# Altium schematic sheet Memory.SchDoc
size C; DocumentNumber: 7; SheetNumber: 7
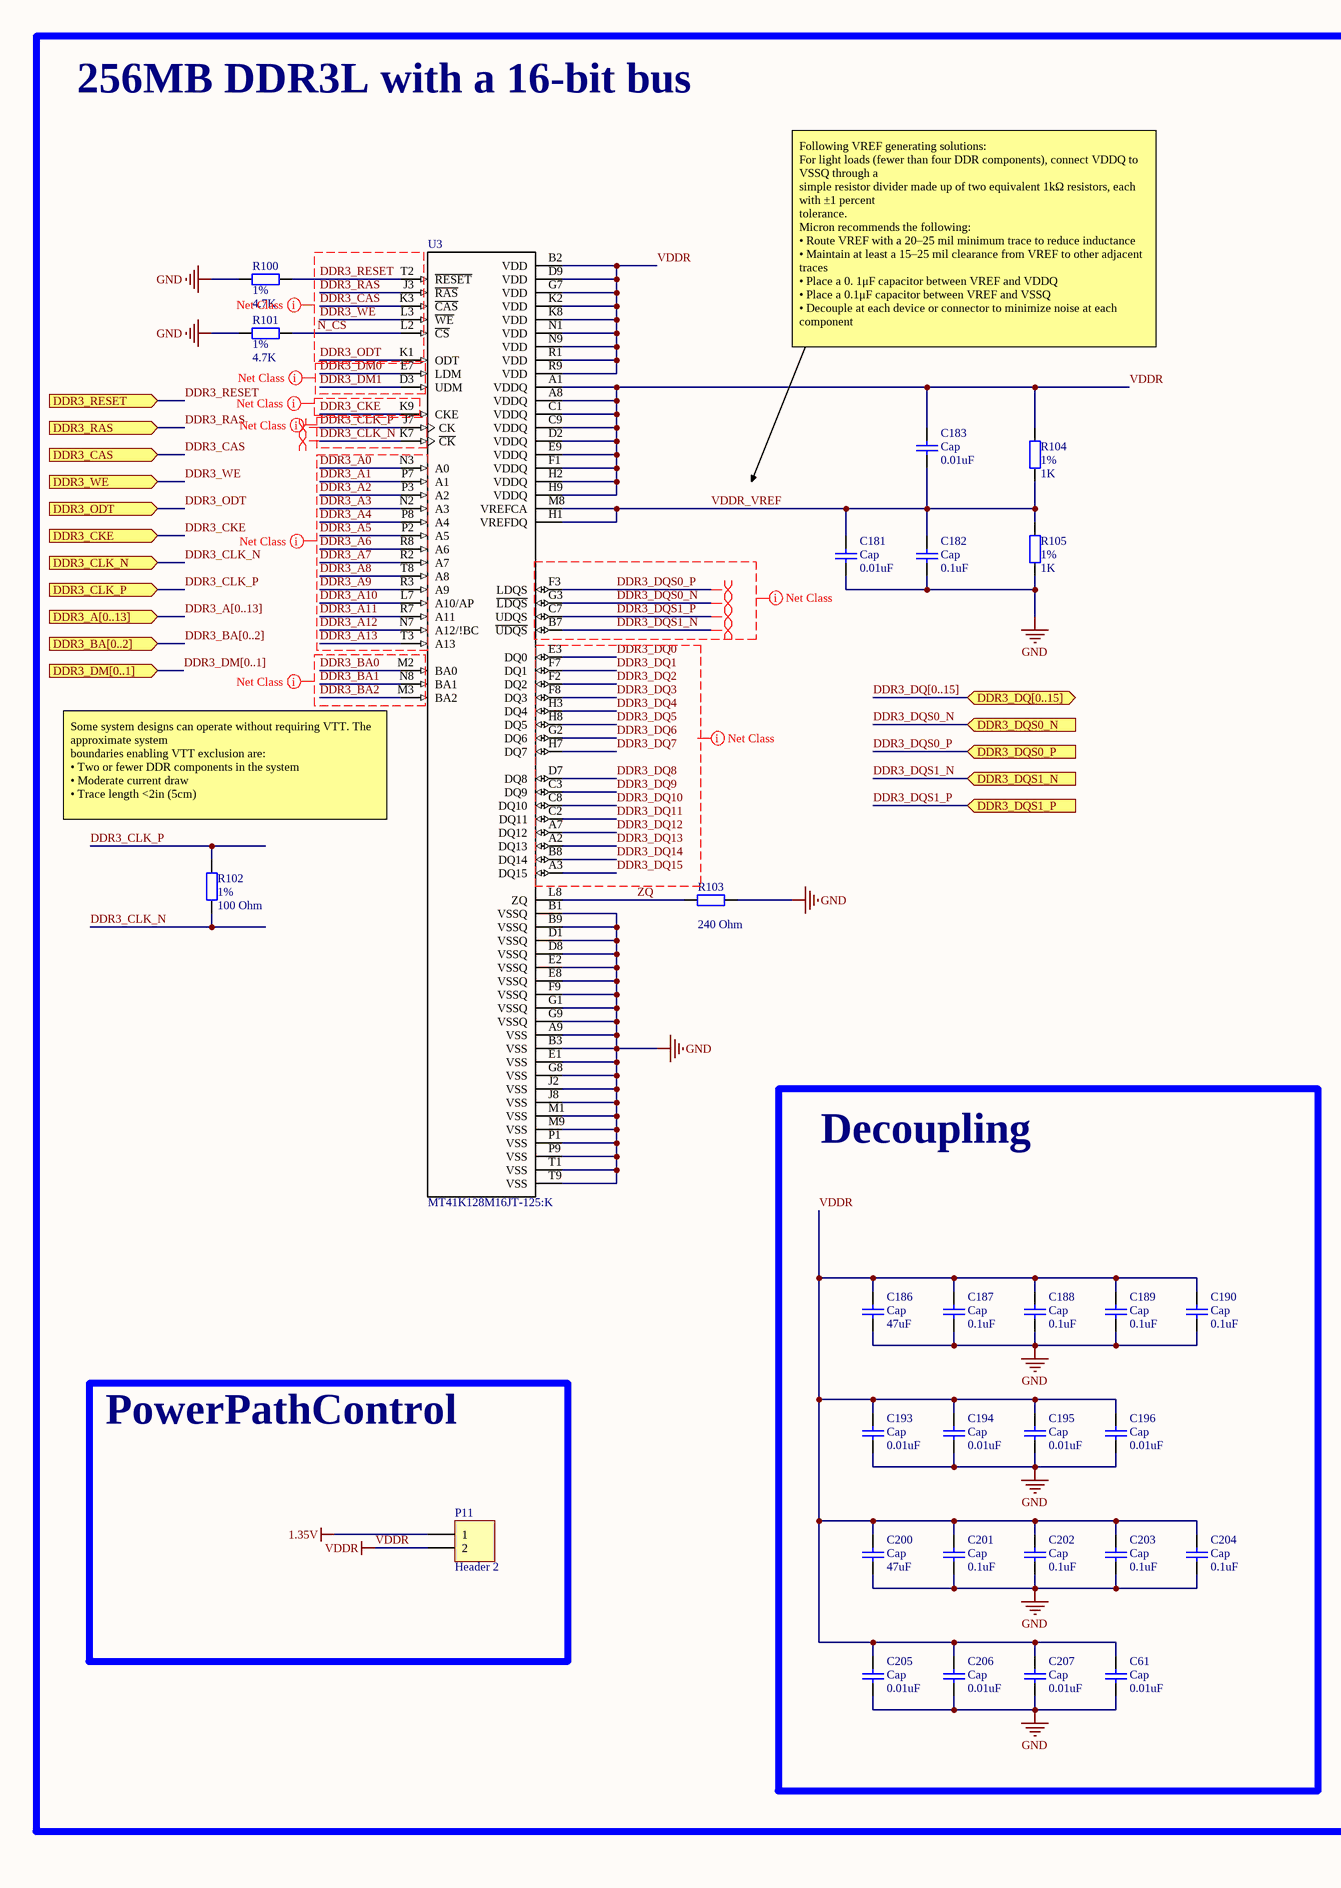
[diagram p0: Memory.SchDoc, left]
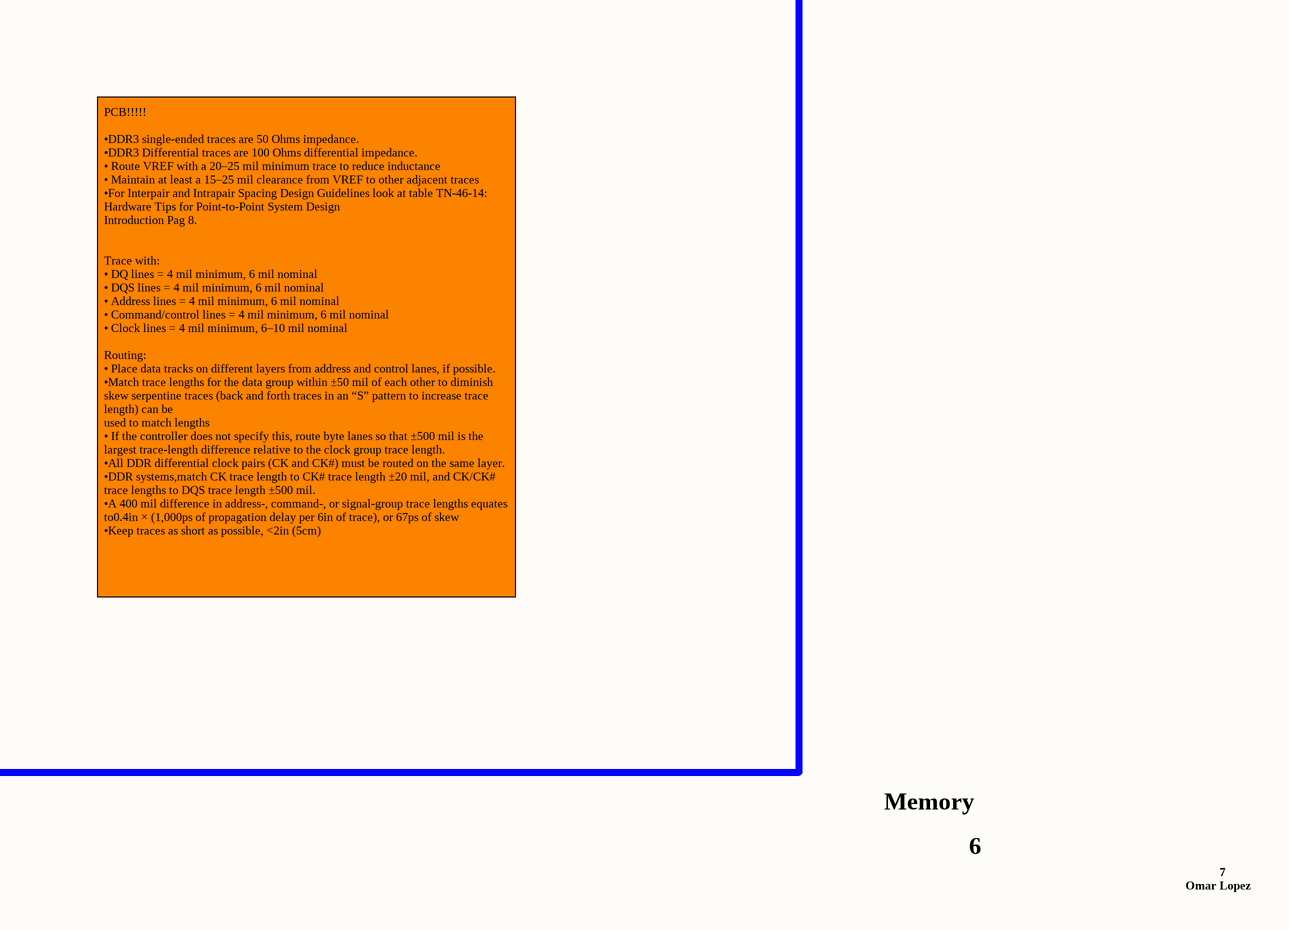
[diagram p1: Memory.SchDoc, right]

## Parts
C61  Cap  value 0.01uF  [GRM0402MurataCap]
C181  Cap  value 0.01uF  [GRM0402MurataCap]
C182  Cap  value 0.1uF  [GRM0402MurataCap]
C183  Cap  value 0.01uF  [GRM0402MurataCap]
C186  Cap  value 47uF  [TaiyoYudenCapMK212]
C187  Cap  value 0.1uF  [GRM0402MurataCap]
C188  Cap  value 0.1uF  [GRM0402MurataCap]
C189  Cap  value 0.1uF  [GRM0402MurataCap]
C190  Cap  value 0.1uF  [GRM0402MurataCap]
C193  Cap  value 0.01uF  [GRM0402MurataCap]
C194  Cap  value 0.01uF  [GRM0402MurataCap]
C195  Cap  value 0.01uF  [GRM0402MurataCap]
C196  Cap  value 0.01uF  [GRM0402MurataCap]
C200  Cap  value 47uF  [TaiyoYudenCapMK212]
C201  Cap  value 0.1uF  [GRM0402MurataCap]
C202  Cap  value 0.1uF  [GRM0402MurataCap]
C203  Cap  value 0.1uF  [GRM0402MurataCap]
C204  Cap  value 0.1uF  [GRM0402MurataCap]
C205  Cap  value 0.01uF  [GRM0402MurataCap]
C206  Cap  value 0.01uF  [GRM0402MurataCap]
C207  Cap  value 0.01uF  [GRM0402MurataCap]
P11  Header 2  [Header2x1]
R100  1%  value 4.7K  [0402Resistor]
R101  1%  value 4.7K  [0402Resistor]
R102  1%  value 100 Ohm  [RC0402N]
R103  value 240 Ohm  [0402Resistor]
R104  1%  value 1K  [RC0402N]
R105  1%  value 1K  [RC0402N]
U3  MT41K128M16JT-125:K  [BGA80P96C6X16_800X1400X110_MT41K128M16JT-125:K(Primary)]

## Blocks framed on the sheet
256MB DDR3L with a 16-bit bus: C181-C183 R100-R105 U3
Decoupling: C61 C186-C190 C193-C196 C200-C207
PowerPathControl: P11

## Ports
DDR3_A[0..13] (in), DDR3_BA[0..2] (in), DDR3_CAS (in), DDR3_CKE (in), DDR3_CLK_N (in), DDR3_CLK_P (in), DDR3_DM[0..1] (in), DDR3_DQ[0..15] (bidir), DDR3_DQS0_N (in), DDR3_DQS0_P (in), DDR3_DQS1_N (in), DDR3_DQS1_P (in), DDR3_ODT (in), DDR3_RAS (in), DDR3_RESET (in), DDR3_WE (in)

## Nets
1.35V: P11.1
GND: C61.2 C181.2 C182.2 C186.2 C187.2 C188.2 C189.2 C190.2 C193.2 C194.2 C195.2 C196.2 C200.2 C201.2 C202.2 C203.2 C204.2 C205.2 C206.2 C207.2 R100.2 R101.2 R103.2 R105.2 U3.A9(VSS) U3.B1(VSSQ) U3.B3(VSS) U3.B9(VSSQ) U3.D1(VSSQ) U3.D8(VSSQ) U3.E1(VSS) U3.E2(VSSQ) U3.E8(VSSQ) U3.F9(VSSQ) U3.G1(VSSQ) U3.G8(VSS) U3.G9(VSSQ) U3.J2(VSS) U3.J8(VSS) U3.M1(VSS) U3.M9(VSS) U3.P1(VSS) U3.P9(VSS) U3.T1(VSS) U3.T9(VSS)
VDDR: C61.1 C183.1 C186.1 C187.1 C188.1 C189.1 C190.1 C193.1 C194.1 C195.1 C196.1 C200.1 C201.1 C202.1 C203.1 C204.1 C205.1 C206.1 C207.1 P11.2 R104.1 U3.A1(VDDQ) U3.A8(VDDQ) U3.B2(VDD) U3.C1(VDDQ) U3.C9(VDDQ) U3.D2(VDDQ) U3.D9(VDD) U3.E9(VDDQ) U3.F1(VDDQ) U3.G7(VDD) U3.H2(VDDQ) U3.H9(VDDQ) U3.K2(VDD) U3.K8(VDD) U3.N1(VDD) U3.N9(VDD) U3.R1(VDD) U3.R9(VDD)
DDR3_A0: U3.N3(A0)
DDR3_A1: U3.P7(A1)
DDR3_A2: U3.P3(A2)
DDR3_A3: U3.N2(A3)
DDR3_A4: U3.P8(A4)
DDR3_A5: U3.P2(A5)
DDR3_A6: U3.R8(A6)
DDR3_A7: U3.R2(A7)
DDR3_A8: U3.T8(A8)
DDR3_A9: U3.R3(A9)
DDR3_A10: U3.L7(A10/AP)
DDR3_A11: U3.R7(A11)
DDR3_A12: U3.N7(A12/!BC)
DDR3_A13: U3.T3(A13)
DDR3_BA0: U3.M2(BA0)
DDR3_BA1: U3.N8(BA1)
DDR3_BA2: U3.M3(BA2)
DDR3_CAS: U3.K3(~{CAS}) ; port DDR3_CAS
DDR3_CKE: U3.K9(CKE) ; port DDR3_CKE
DDR3_CLK_N: R102.1 U3.K7(~{CK}) ; port DDR3_CLK_N
DDR3_CLK_P: R102.2 U3.J7(CK) ; port DDR3_CLK_P
DDR3_DM0: U3.E7(LDM)
DDR3_DM1: U3.D3(UDM)
DDR3_DQ0: U3.E3(DQ0)
DDR3_DQ1: U3.F7(DQ1)
DDR3_DQ2: U3.F2(DQ2)
DDR3_DQ3: U3.F8(DQ3)
DDR3_DQ4: U3.H3(DQ4)
DDR3_DQ5: U3.H8(DQ5)
DDR3_DQ6: U3.G2(DQ6)
DDR3_DQ7: U3.H7(DQ7)
DDR3_DQ8: U3.D7(DQ8)
DDR3_DQ9: U3.C3(DQ9)
DDR3_DQ10: U3.C8(DQ10)
DDR3_DQ11: U3.C2(DQ11)
DDR3_DQ12: U3.A7(DQ12)
DDR3_DQ13: U3.A2(DQ13)
DDR3_DQ14: U3.B8(DQ14)
DDR3_DQ15: U3.A3(DQ15)
DDR3_DQS0_N: U3.G3(~{LDQS}) ; port DDR3_DQS0_N
DDR3_DQS0_P: U3.F3(LDQS) ; port DDR3_DQS0_P
DDR3_DQS1_N: U3.B7(~{UDQS}) ; port DDR3_DQS1_N
DDR3_DQS1_P: U3.C7(UDQS) ; port DDR3_DQS1_P
DDR3_ODT: U3.K1(ODT) ; port DDR3_ODT
DDR3_RAS: U3.J3(~{RAS}) ; port DDR3_RAS
DDR3_RESET: R100.1 U3.T2(~{RESET}) ; port DDR3_RESET
DDR3_WE: U3.L3(~{WE}) ; port DDR3_WE
N_CS: R101.1 U3.L2(~{CS})
VDDR_VREF: C181.1 C182.1 C183.2 R104.2 R105.1 U3.H1(VREFDQ) U3.M8(VREFCA)
ZQ: R103.1 U3.L8(ZQ)

## Buses and harness runs
bus DDR3_A[0..13] = port DDR3_A[0..13]
bus DDR3_BA[0..2] = port DDR3_BA[0..2]
bus DDR3_DM[0..1] = port DDR3_DM[0..1]
bus DDR3_DQ[0..15] = port DDR3_DQ[0..15]

## Layout directives
differential pair; net class DDR3_Diff80: DDR3_DQS0_N, DDR3_DQS0_P, DDR3_DQS1_N, DDR3_DQS1_P
differential pair; net class DDR3_Diff100: DDR3_CLK_N, DDR3_CLK_P
net class DDR3_Data; net class DataGroup: DDR3_DQ0, DDR3_DQ1, DDR3_DQ2, DDR3_DQ3, DDR3_DQ4, DDR3_DQ5, DDR3_DQ6, DDR3_DQ7, DDR3_DQ8, DDR3_DQ9, DDR3_DQ10, DDR3_DQ11, DDR3_DQ12, DDR3_DQ13, DDR3_DQ14, DDR3_DQ15
net class DDR3_DQS; net class DataGroup: DDR3_DQS0_N, DDR3_DQS0_P, DDR3_DQS1_N, DDR3_DQS1_P
net class DDR3_Address; net class AddressGroup: DDR3_A0, DDR3_A1, DDR3_A2, DDR3_A3, DDR3_A4, DDR3_A5, DDR3_A6, DDR3_A7, DDR3_A8, DDR3_A9, DDR3_A10, DDR3_A11, DDR3_A12, DDR3_A13
net class DDR3_BA; net class AddressGroup: DDR3_BA0, DDR3_BA1, DDR3_BA2
net class DDR3_CLK; net class ClockGroup: DDR3_CLK_N, DDR3_CLK_P
net class DDR3_DM; net class DataGroup: DDR3_DM0, DDR3_DM1
net class ControlGroup: DDR3_CAS, DDR3_CKE, DDR3_ODT, DDR3_RAS, DDR3_RESET, DDR3_WE, N_CS

## Notes on the sheet
- Following VREF generating solutions:
  For light loads (fewer than four DDR components), connect VDDQ to VSSQ through a
  simple resistor divider made up of two equivalent 1kΩ resistors, each with ±1 percent
  tolerance.
  Micron recommends the following:
  • Route VREF with a 20–25 mil minimum trace to reduce inductance
  • Maintain at least a 15–25 mil clearance from VREF to other adjacent traces
  • Place a 0. 1μF capacitor between VREF and VDDQ
  • Place a 0.1μF capacitor between VREF and VSSQ
  • Decouple at each device or connector to minimize noise at each component
- Some system designs can operate without requiring VTT. The approximate system
  boundaries enabling VTT exclusion are:
  • Two or fewer DDR components in the system
  • Moderate current draw
  • Trace length <2in (5cm)
- PCB!!!!!
  •DDR3 single-ended traces are 50 Ohms impedance.
  •DDR3 Differential traces are 100 Ohms differential impedance.
  • Route VREF with a 20–25 mil minimum trace to reduce inductance
  • Maintain at least a 15–25 mil clearance from VREF to other adjacent traces
  •For Interpair and Intrapair Spacing Design Guidelines look at table TN-46-14: Hardware Tips for Point-to-Point System Design
  Introduction Pag 8.
  Trace with:
  • DQ lines = 4 mil minimum, 6 mil nominal
  • DQS lines = 4 mil minimum, 6 mil nominal
  • Address lines = 4 mil minimum, 6 mil nominal
  • Command/control lines = 4 mil minimum, 6 mil nominal
  • Clock lines = 4 mil minimum, 6–10 mil nominal
  Routing:
  • Place data tracks on different layers from address and control lanes, if possible.
  •Match trace lengths for the data group within ±50 mil of each other to diminish skew serpentine traces (back and forth traces in an “S” pattern to increase trace length) can be
  used to match lengths
  • If the controller does not specify this, route byte lanes so that ±500 mil is the largest trace-length difference relative to the clock group trace length.
  •All DDR differential clock pairs (CK and CK#) must be routed on the same layer.
  •DDR systems,match CK trace length to CK# trace length ±20 mil, and CK/CK# trace lengths to DQS trace length ±500 mil.
  •A 400 mil difference in address-, command-, or signal-group trace lengths equates to0.4in × (1,000ps of propagation delay per 6in of trace), or 67ps of skew
  •Keep traces as short as possible, <2in (5cm)
- Memory
- 6
- Omar Lopez
- 7

## Library data of the parts
C61 C181 C183 C193-C196 C205-C207 = Cap: Capacitor; Manufacturer: Murata; PartNumber: GRM155R71E103KA01D; Tolerance: 10%; Descripción: SMD/SMT 0402 0.01uF 25volts X7R 10%; CostoVendedor1: 0.027; Vendedor1: Mouser; Vendedor2: Digi-Key; Package: 0402; DataSheet: http://www.mouser.com/ds/2/281/c02e-2905.pdf; LinkVendedor1: https://ar.mouser.com/ProductDetail/Murata-Electronics/GRM155R71E103KA01D?utm_term=GRM155R71E103KA01D&qs=tOieHv2smhmMGFtkNVb1ug%3d%3d&utm_campaign=GRM155R71E103KA01D&utm_medium=aggregator&utm_source=findchips&utm_content=Murata
C182 C187-C190 C201-C204 = Cap: Capacitor; Manufacturer: Murata; PartNumber: GRM155R71C104KA88D; Tolerance: 10%; Descripción: 16V  smd; CostoVendedor1: 0.038; Vendedor1: Mouser; Vendedor2: Digi-Key; Package: 0402; DataSheet: http://www.mouser.com/ds/2/281/c02e-2905.pdf
C186 C200 = Cap: Capacitor; Manufacturer: Taiyo Yuden; PartNumber: JMK212BJ476MG-T; Tolerance: 20%; Descripción: Capacitores cerámicos de capas múltiples (MLCC) - SMD/SMT 47uF 6.3V X5R +/-20% 0805 Gen Purp; Vendedor1: Mouser; Vendedor2: Digi-Key; DataSheet: http://www.mouser.com/ds/2/396/mlcc_all_e-541559.pdf
P11 = Header 2: Header, 2-Pin; Vendedor1: Mouser; Vendedor2: Digi-Key
R100 R101 = Res2: Resistor; Manufacturer: Vishay; PartNumber: CRCW04024K70FKED; Descripción: Resistores de película gruesa - SMD 1/16watt 4.7Kohms 1%; Vendedor1: Mouser; Vendedor2: Digi-Key; Package: 0402; Tolerance: 1%; DataSheet: http://www.mouser.com/ds/2/315/AOA0000C104-947597.pdf
R102 = Res2: Resistor; Manufacturer: Panasonic; PartNumber: ERJ-2RKF1000X; Descripción: Anti-Sulfur  100 mW 50V; CostoVendedor1: 0.021; Vendedor1: Mouser; Vendedor2: Digi-Key; Package: 0402; Tolerance: 1%; DataSheet: http://www.mouser.com/ds/2/315/AOA0000C104-947597.pdf; LinkVendedor1: https://ar.mouser.com/ProductDetail/Panasonic/ERJ-2RKF1000X?qs=sGAEpiMZZMu61qfTUdNhGzxKJJelZRhEGST%2FbP4fbIc%3D
R103 = Res2: Resistor; Manufacturer: Vishay; PartNumber: CRCW040240R2FKED; Tolerance: 1%; Descripción: Resistores de película gruesa - SMD 1/16watt 240ohms 1%; Vendedor1: Mouser; Vendedor2: Digi-Key; Package: 0402; DataSheet: http://www.mouser.com/ds/2/315/AOA0000C86-911473.pdf
R104 R105 = Res2: Resistor; Manufacturer: Panasonic; PartNumber: ERJ-2RKF1001X; Descripción: 100mW 50V; Vendedor1: Mouser; Vendedor2: Digi-Key; Tolerance: 1%; DataSheet: http://www.mouser.com/ds/2/315/AOA0000C86-911473.pdf
U3 = MT41K128M16JT-125:K: DRAM Chip DDR3L SDRAM 2G-Bit 128Mx16 1.35V 96-Pin FBGA; Manufacturer: Micron; CostoVendedor2: 10.53; Vendedor1: Mouser; Vendedor2: Digi-Key; Package: TFBGA-96 Micron; Value: *; DataSheet: https://4donline.ihs.com/images/VipMasterIC/IC/MICT/MICT-S-A0002296722/MICT-S-A0002296722-1.pdf; Descripción: DRAM Chip DDR3L SDRAM 2G-Bit 128Mx16 1.35V 96-Pin FBGA; PartNumber: MT41K128M16JT-125:K; LinkVendedor2: https://www.digikey.com/product-detail/en/micron-technology-inc/MT41K128M16JT-125-XIT:K/557-1753-ND/4072478?utm_campaign=buynow&utm_medium=aggregator&WT.z_cid=ref_findchips_standard&utm_source=findchips